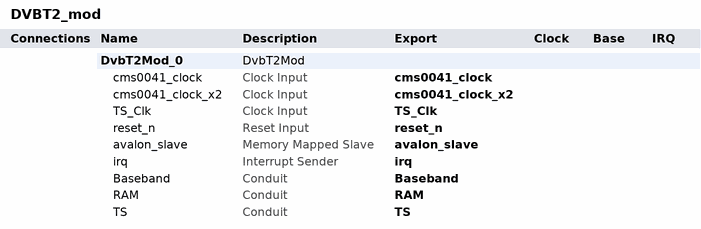
[diagram p0: system contents]
# Platform Designer (Qsys) system DVBT2_mod, Cyclone V 5CEBA9F23C8
# Parameters at their usual value, and those the tool derives, are not listed.
package require qsys
create_system DVBT2_mod
set_project_property DEVICE_FAMILY {Cyclone V}
set_project_property DEVICE 5CEBA9F23C8

add_instance DvbT2Mod_0 DvbT2Mod 6.8
set_instance_property DvbT2Mod_0 AUTO_EXPORT true
set_instance_parameter_value DvbT2Mod_0 BUILD_CITL_CACHE 0
set_instance_parameter_value DvbT2Mod_0 BUILD_CPU_BYTE_ADDR_WIDTH 20
set_instance_parameter_value DvbT2Mod_0 BUILD_SDRAM_WORD_ADDR_WIDTH 24
set_instance_parameter_value DvbT2Mod_0 CLOCK_FREQUENCY_KHZ 100000
set_instance_parameter_value DvbT2Mod_0 GUI_BASEBAND_OUTPUT true
set_instance_parameter_value DvbT2Mod_0 GUI_BASE_TO_IF true
set_instance_parameter_value DvbT2Mod_0 GUI_CALCULATE_TS_RATE true
set_instance_parameter_value DvbT2Mod_0 GUI_CLOCK_RIF_FREQUENCY_KHZ 100000
set_instance_parameter_value DvbT2Mod_0 GUI_CRITICAL_FILTER Normal
set_instance_parameter_value DvbT2Mod_0 GUI_DAC_PROGRAM true
set_instance_parameter_value DvbT2Mod_0 GUI_DAC_PROG_CLOCK_FREQUENCY_KHZ 100000
set_instance_parameter_value DvbT2Mod_0 GUI_DEVICE_FAMILY Generic
set_instance_parameter_value DvbT2Mod_0 GUI_DUAL_CLOCK_DOMAIN false
set_instance_parameter_value DvbT2Mod_0 GUI_FEF_SUPPORT false
set_instance_parameter_value DvbT2Mod_0 GUI_FFT_WINDOW false
set_instance_parameter_value DvbT2Mod_0 GUI_IDV_ADDR_EXTRACTION false
set_instance_parameter_value DvbT2Mod_0 GUI_IF_ONLY true
set_instance_parameter_value DvbT2Mod_0 GUI_INBAND_EQUALISER false
set_instance_parameter_value DvbT2Mod_0 GUI_L1ACE_PROCESSOR false
set_instance_parameter_value DvbT2Mod_0 GUI_MAX_FFT_SIZE 8k
set_instance_parameter_value DvbT2Mod_0 GUI_OSG_USE_INTERNAL_RAM true
set_instance_parameter_value DvbT2Mod_0 GUI_P2_BIAS_CELLS false
set_instance_parameter_value DvbT2Mod_0 GUI_PAPR true
set_instance_parameter_value DvbT2Mod_0 GUI_PCR_SUPPORT true
set_instance_parameter_value DvbT2Mod_0 GUI_PLL_PROGRAM None
set_instance_parameter_value DvbT2Mod_0 GUI_PLL_PROG_CLOCK_FREQUENCY_KHZ 100000
set_instance_parameter_value DvbT2Mod_0 GUI_PRBS_PACKETS true
set_instance_parameter_value DvbT2Mod_0 GUI_PRE_DISTORT true
set_instance_parameter_value DvbT2Mod_0 GUI_RAM_TEST_SUPPORT false
set_instance_parameter_value DvbT2Mod_0 GUI_REGBANK_INITIALISATION true
set_instance_parameter_value DvbT2Mod_0 GUI_RIF None
set_instance_parameter_value DvbT2Mod_0 GUI_SEPARATE_DAC_PROG_CLOCK {Core Clock}
set_instance_parameter_value DvbT2Mod_0 GUI_SEPARATE_PLL_PROG_CLOCK {Core Clock}
set_instance_parameter_value DvbT2Mod_0 GUI_SFN_SUPPORT false
set_instance_parameter_value DvbT2Mod_0 GUI_SUPPORTED_PLP_NUM 1
set_instance_parameter_value DvbT2Mod_0 GUI_T2ADAPT true
set_instance_parameter_value DvbT2Mod_0 GUI_T2MI false
set_instance_parameter_value DvbT2Mod_0 GUI_USE_CONFIG_PACK true

# exported interfaces
add_interface Baseband conduit end
set_interface_property Baseband EXPORT_OF DvbT2Mod_0.Baseband
add_interface RAM conduit end
set_interface_property RAM EXPORT_OF DvbT2Mod_0.RAM
add_interface TS conduit end
set_interface_property TS EXPORT_OF DvbT2Mod_0.TS
add_interface TS_Clk clock sink
set_interface_property TS_Clk EXPORT_OF DvbT2Mod_0.TS_Clk
add_interface avalon_slave avalon slave
set_interface_property avalon_slave EXPORT_OF DvbT2Mod_0.avalon_slave
add_interface cms0041_clock clock sink
set_interface_property cms0041_clock EXPORT_OF DvbT2Mod_0.cms0041_clock
add_interface cms0041_clock_x2 clock sink
set_interface_property cms0041_clock_x2 EXPORT_OF DvbT2Mod_0.cms0041_clock_x2
add_interface irq interrupt sender
set_interface_property irq EXPORT_OF DvbT2Mod_0.irq
add_interface reset_n reset sink
set_interface_property reset_n EXPORT_OF DvbT2Mod_0.reset_n

set_interconnect_requirement {$system} qsys_mm.clockCrossingAdapter HANDSHAKE
set_interconnect_requirement {$system} qsys_mm.enableEccProtection FALSE
set_interconnect_requirement {$system} qsys_mm.insertDefaultSlave FALSE
set_interconnect_requirement {$system} qsys_mm.maxAdditionalLatency 1

save_system DVBT2_mod.qsys
